# Altium project Soldeerbout.PrjPcb
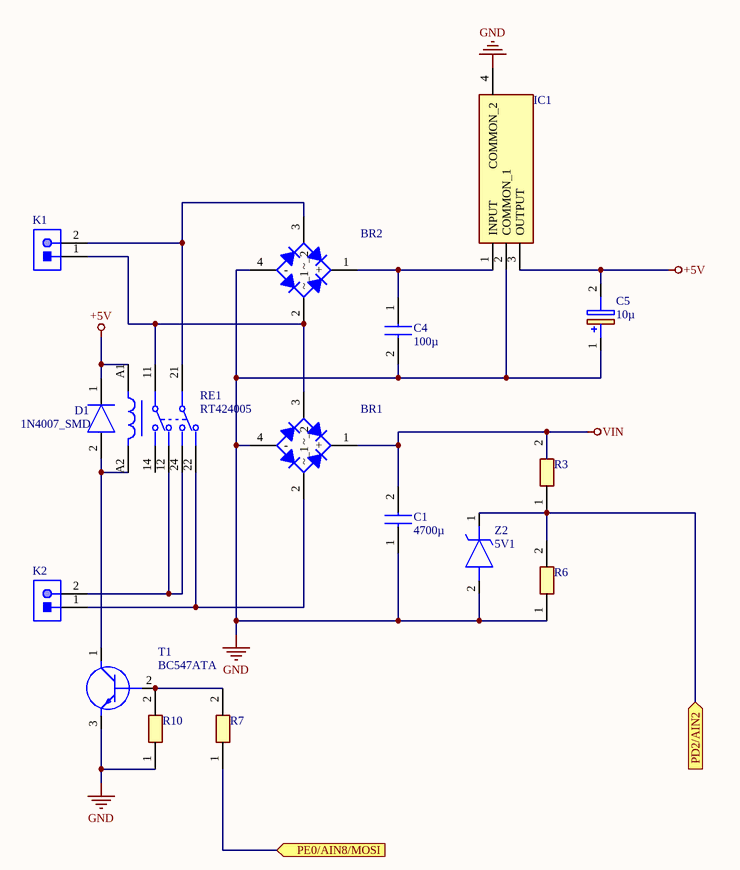
[diagram p0: Voeding.SchDoc]
4 sheets, 76 parts. Net scope: flat (ports and power ports of the same name join across sheets).
Board file: Soldeerstation.PcbDoc
Sheets:
  Voeding.SchDoc
  Atmega.SchDoc
  Boutconectie.SchDoc
  Display.SchDoc

## Sheet Voeding.SchDoc
size A4; SheetNumber: 1; SheetTotal: 4

### Parts
BR1  GBU6J-E3_45  [GBU6JE345]  (value not drawn)
BR2  GBU6J-E3_45  [GBU6JE345]  (value not drawn)
C1  4700µ  [CAPPRD1000W80D2200H4100]
C4  100µ  [CAPPRD350W52D800H1300]
C5  10µ  [CAPPRD200W52D500H1250]
D1  1N4007_SMD  [DIOM5027X262N]
IC1  TL780-05CKTTR  [TL78005CKTTR]  (value not drawn)
K1  620102131822  [620102131822]  (value not drawn)
K2  620102131822  [620102131822]  (value not drawn)
R3  (no value)  [RESC2012X90N]
R6  (no value)  [RESC2012X90N]
R7  (no value)  [RESC2012X90N]
R10  (no value)  [RESC2012X90N]
RE1  RT424005  [RT42]
T1  BC547ATA  [TO-92_(TO-226)]
Z2  5V1  [SODFL1608X65N]

### Ports
PD2/AIN2 (in), PE0/AIN8/MOSI (in)

### Nets
+5V: C5.2(-) D1.1(K) IC1.3(OUTPUT) RE1.A1
GND: BR1.4(-) BR2.4(-) C1.1(+) C4.2(-) C5.1(+) IC1.2(COMMON_1) IC1.4(COMMON_2) R6.1 R10.1 T1.3(E) Z2.2(A)
VIN: BR1.1(+) C1.2(-) R3.2
NetBR1_2: BR1.2(~_1) K2.1 RE1.22
NetBR1_3: BR1.3(~_2) BR2.2(~_1) K1.1 RE1.11
NetBR2_1: BR2.1(+) C4.1(+) IC1.1(INPUT)
NetBR2_3: BR2.3(~_2) K1.2 RE1.21
NetD1_2: D1.2(A) RE1.A2 T1.1(C)
NetK2_2: K2.2 RE1.12 RE1.24
NetR3_1: R3.1 R6.2 Z2.1(K) ; port PD2/AIN2
NetR7_1: R7.1 ; port PE0/AIN8/MOSI
NetR7_2: R7.2 R10.2 T1.2(B)

Not connected (* = marked no-connect by the designer): RE1 14

### Library data of the parts
BR1 BR2 = GBU6J-E3_45: Bridge Rectifier; Manufacturer_Name: Vishay; Manufacturer_Part_Number: GBU6J-E3/45; Datasheet Link: http://www.vishay.com/docs/88615/gbu6a.pdf; Height: 18.8mm
C1 = 860010683032: Capacitor; Manufacturer_Name: Wurth Elektronik; Datasheet Link: https://componentsearchengine.com/Datasheets/2/860010683032.pdf; Height: 41mm; Manufacturer_Part_Number: 860010683032; Mouser Part Number: 710-860010683032; Mouser Price/Stock: https://www.mouser.co.uk/ProductDetail/Wurth-Elektronik/860010683032?qs=0KOYDY2FL2%252Biyra9tgGF6Q%3D%3D
C4 = 860010674014: Capacitor; Manufacturer_Name: Wurth Elektronik; Datasheet Link: http://uk.rs-online.com/web/p/products/8397074; Height: 13mm; Manufacturer_Part_Number: 860010674014; Mouser Part Number: 710-860010674014; Mouser Price/Stock: https://www.mouser.co.uk/ProductDetail/Wurth-Elektronik/860010674014?qs=0KOYDY2FL2%2Fk%2F1RkUOIquw%3D%3D
C5 = 860010672009: Capacitor Polarised; Manufacturer_Name: Wurth Elektronik; Datasheet Link: https://componentsearchengine.com/Datasheets/2/860010672009.pdf; Height: 12.5mm; Manufacturer_Part_Number: 860010672009; Mouser Part Number: 710-860010672009; Mouser Price/Stock: https://www.mouser.com/Search/Refine.aspx?Keyword=710-860010672009
D1 = 1N4007_SMD: Diode; Manufacturer_Name: MULTICOMP; Manufacturer_Part_Number: 1N4007 SMD; Datasheet Link: https://componentsearchengine.com/Datasheets/2/1N4007 SMD.pdf; Height: 2.62mm
IC1 = TL780-05CKTTR: Integrated Circuit; Manufacturer_Name: Texas Instruments; Datasheet Link: http://www.ti.com/general/docs/suppproductinfo.tsp?distId=26&gotoUrl=http%3A%2F%2Fwww.ti.com%2Flit%2Fgpn%2Ftl780; Height: 5.08mm; Manufacturer_Part_Number: TL780-05CKTTR; Mouser Part Number: 595-TL780-05CKTTR; Mouser Price/Stock: https://www.mouser.co.uk/ProductDetail/Texas-Instruments/TL780-05CKTTR?qs=7kv20MEVUlhtPP21hgiOlA%3D%3D; Arrow Part Number: TL780-05CKTTR; Arrow Price/Stock: https://www.arrow.com/en/products/tl780-05ckttr/texas-instruments?region=nac
K1 K2 = CMP-1502-00669-1: Male Shrouded Header WR-WTB, SMT, Right Angled, pitch 2 mm, 1 x 2 position; Manufacturer: Wurth Elektronik; Position: 1x2; Working Voltage: 100VAC; Contact Resistance: 20mOhm; Pitch: 2mm; Packaging: TapeandReel; Part Number: 620102131822; Publisher: WurthElektronik; Mounting Technology: SMT; Manufacturer URL: http://www.we-online.de; Datasheet URL: https://katalog.we-online.de/em/datasheet/6201xx131822.pdf; Gender: Male; Operating Temperature: -25to85degC; Package Reference: 620102131822; Orientation: RightAngled
R3 R6 R7 R10 = CFN0805-JZ-R010ELF: Resistor; Manufacturer_Name: Bourns; Datasheet Link: https://www.bourns.com/docs/Product-Datasheets/CFN.pdf; Height: 0.9mm; Manufacturer_Part_Number: CFN0805-JZ-R010ELF
RE1 = RT424005: Relay or Contactor; Manufacturer_Name: TE Connectivity; Datasheet Link: https://www.te.com/commerce/DocumentDelivery/DDEController?Action=showdoc&DocId=Data+Sheet%7FRT2%7F1014%7Fpdf%7FEnglish%7FENG_DS_RT2_1014.pdf%7F5-1393243-9; Manufacturer_Part_Number: RT424005; Mouser Part Number: 655-RT424005; Mouser Price/Stock: https://www.mouser.co.uk/ProductDetail/TE-Connectivity-Schrack/RT424005?qs=KKrrU%252BaSadKRsQcVuAjnsQ%3D%3D; Arrow Part Number: RT424005; Arrow Price/Stock: https://www.arrow.com/en/products/rt424005/te-connectivity?region=nac
T1 = BC547ATA: Transistor BJT NPN; Manufacturer_Name: ON Semiconductor; Datasheet Link: https://www.onsemi.com/pub/Collateral/BC550-D.pdf; Manufacturer_Part_Number: BC547ATA; Mouser Part Number: 512-BC547ATA; Mouser Price/Stock: https://www.mouser.co.uk/ProductDetail/ON-Semiconductor-Fairchild/BC547ATA?qs=ljbEvF4DwOMRdLfuzO8N4w%3D%3D; Arrow Part Number: BC547ATA; Arrow Price/Stock: https://www.arrow.com/en/products/bc547ata/on-semiconductor?region=europe
Z2 = BZT52C12TQ-7-F: Zener Diode; Manufacturer_Name: Diodes Inc.; Datasheet Link: https://www.diodes.com/assets/Datasheets/ds30502.pdf; Height: 0.65mm; Manufacturer_Part_Number: BZT52C12TQ-7-F; Mouser Part Number: 621-BZT52C12TQ-7-F; Mouser Price/Stock: https://www.mouser.co.uk/ProductDetail/Diodes-Incorporated/BZT52C12TQ-7-F?qs=W0yvOO0ixfHNmW9JdWu87w%3D%3D; Arrow Part Number: BZT52C12TQ-7-F; Arrow Price/Stock: https://www.arrow.com/en/products/bzt52c12tq-7-f/diodes-incorporated?region=nac

## Sheet Atmega.SchDoc
size A4; SheetNumber: 2; SheetTotal: 4
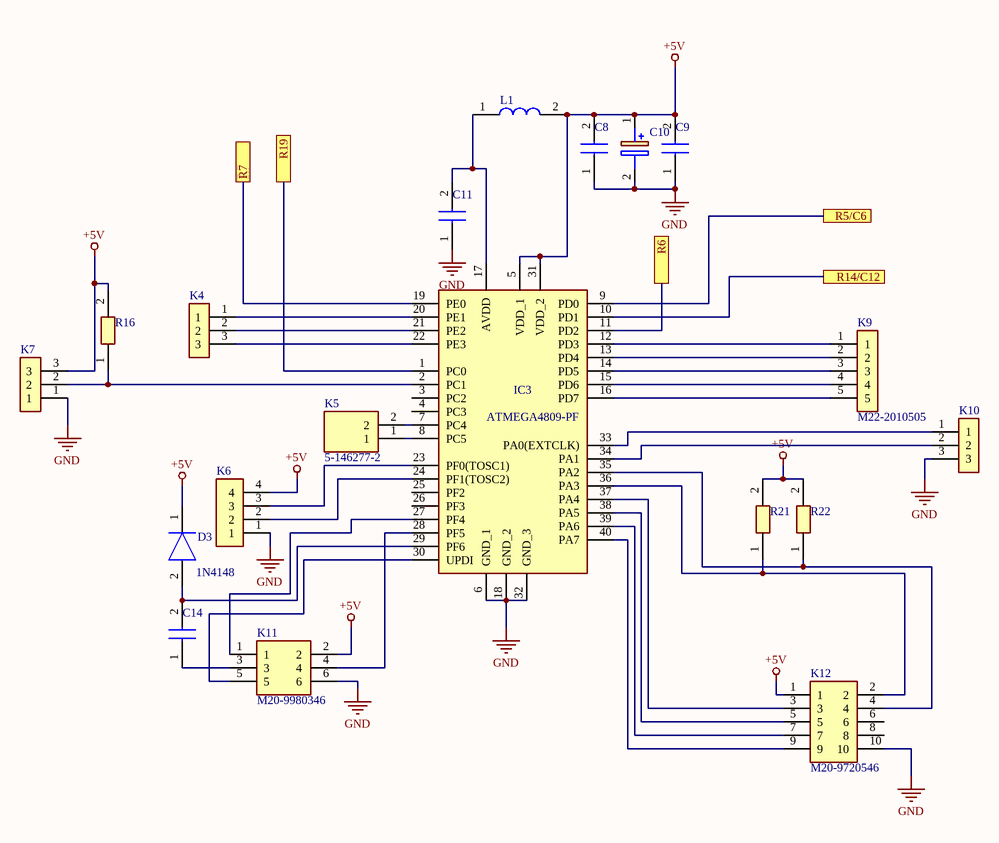
[diagram p1: Atmega.SchDoc]

### Parts
C8  (no value)  [CAPC2012X95N]
C9  (no value)  [CAPC2012X95N]
C10  10µ  [CAPPRD200W52D500H1250]  (value not drawn)
C11  (no value)  [CAPC2012X95N]
C14  (no value)  [CAPC2012X95N]
D3  1N4148  [1N4148WRHG]
IC3  ATMEGA4809-PF  [DIP1543W58P254L5175H635Q40N]
K4  09-65-2038  [SHDR3W160P0X396_1X3_1112X1062X1425P]  (value not drawn)
K5  5-146277-2  [HDRV2W67P0X254_1X2_467X234X823P]
K6  (no value)  [HDRV4W64P0X254_1X4_1016X254X864P]
K7  (no value)  [HDRV3W60P0X200_1X3_600X200X525P]
K9  M22-2010505  [HDRV5W50P0X200_1X5_1000X200X530P]
K10  (no value)  [HDRV3W60P0X200_1X3_600X200X525P]
K11  M20-9980346  [HDRV6W64P254_2X3_762X508X868P]
K12  M20-9720546  [HDRV10W64P254_2X5_1270X508X954P]
L1  FDSD0518-H-100M=P3  [FDSD0518H100MP3]  (value not drawn)
R16  (no value)  [RESC2012X90N]
R21  (no value)  [RESC2012X90N]
R22  (no value)  [RESC2012X90N]

### Ports
R5/C6, R6, R7, R14/C12, R19

### Nets
+5V: C8.2 C9.2 C10.1(+) D3.1(K) IC3.5(VDD_1) IC3.31(VDD_2) K6.4 K7.3 K11.2 K12.1 L1.2 R16.2 R21.2 R22.2
GND: C8.1 C9.1 C10.2(-) C11.1 IC3.6(GND_1) IC3.18(GND_2) IC3.32(GND_3) K6.1 K7.1 K10.3 K11.6 K12.10
NetC11_2: C11.2 IC3.17(AVDD) L1.1
NetC14_1: C14.1 K11.3
NetC14_2: C14.2 D3.2(A) IC3.29(PF6)
NetIC3_1: IC3.1(PC0) ; port R19
NetIC3_2: IC3.2(PC1) K7.2 R16.1
NetIC3_7: IC3.7(PC4) K5.2
NetIC3_8: IC3.8(PC5) K5.1
NetIC3_9: IC3.9(PD0) ; port R5/C6
NetIC3_10: IC3.10(PD1) ; port R14/C12
NetIC3_11: IC3.11(PD2) ; port R6
NetIC3_12: IC3.12(PD3) K9.1
NetIC3_13: IC3.13(PD4) K9.2
NetIC3_14: IC3.14(PD5) K9.3
NetIC3_15: IC3.15(PD6) K9.4
NetIC3_16: IC3.16(PD7) K9.5
NetIC3_19: IC3.19(PE0) ; port R7
NetIC3_20: IC3.20(PE1) K4.1
NetIC3_21: IC3.21(PE2) K4.2
NetIC3_22: IC3.22(PE3) K4.3
NetIC3_23: IC3.23(PF0(TOSC1)) K6.3
NetIC3_24: IC3.24(PF1(TOSC2)) K6.2
NetIC3_27: IC3.27(PF4) K11.1
NetIC3_28: IC3.28(PF5) K11.4
NetIC3_30: IC3.30(UPDI) K11.5
NetIC3_33: IC3.33(PA0(EXTCLK)) K10.1
NetIC3_34: IC3.34(PA1) K10.2
NetIC3_35: IC3.35(PA2) K12.4 R22.1
NetIC3_36: IC3.36(PA3) K12.2 R21.1
NetIC3_37: IC3.37(PA4) K12.3
NetIC3_38: IC3.38(PA5) K12.5
NetIC3_39: IC3.39(PA6) K12.7
NetIC3_40: IC3.40(PA7) K12.9

Not connected (* = marked no-connect by the designer): IC3 3(PC2) 4(PC3) 25(PF2) 26(PF3); K12 6 8

### Library data of the parts
C8 C9 C11 C14 = CC0805KPX7R9BB104: Capacitor; Manufacturer_Name: KEMET; Datasheet Link: https://www.yageo.com/upload/media/product/productsearch/datasheet/mlcc/UPY-GPHC_X7R_6.3V-to-50V_20.pdf; Height: 0.95mm; Manufacturer_Part_Number: CC0805KPX7R9BB104
C10 = 860010672009: as C5 on sheet Voeding; Datasheet Link: https://componentsearchengine.com/Datasheets/2/860010672009.pdf; Height: 12.5mm; Manufacturer_Part_Number: 860010672009; Mouser Part Number: 710-860010672009; Mouser Price/Stock: https://www.mouser.com/Search/Refine.aspx?Keyword=710-860010672009
D3 = 1N4148W_RHG: Diode; Manufacturer_Name: Taiwan Semiconductor; Manufacturer_Part_Number: 1N4148W RHG; Datasheet Link: https://mouser.componentsearchengine.com/Datasheets/1/1N4148W RHG.pdf; Height: 1.15mm; Mouser Part Number: 821-1N4148WRHG; Mouser Price/Stock: https://www.mouser.co.uk/ProductDetail/Taiwan-Semiconductor/1N4148W-RHG?qs=KwaGCOX4wIag2YPLXylAvA%3D%3D; Arrow Part Number: 1N4148W RHG; Arrow Price/Stock: https://www.arrow.com/en/products/1n4148wrhg/taiwan-semiconductor?region=nac
IC3 = ATMEGA4809-PF: Integrated Circuit; Manufacturer_Name: Microchip; Datasheet Link: http://ww1.microchip.com/downloads/en/DeviceDoc/40-pin-Data-Sheet-megaAVR-0-series-DS40002104A.pdf; Height: 6.35mm; Manufacturer_Part_Number: ATMEGA4809-PF; Mouser Part Number: 556-ATMEGA4809-PF; Mouser Price/Stock: https://www.mouser.co.uk/ProductDetail/Microchip-Technology-Atmel/ATMEGA4809-PF?qs=T3oQrply3y9UlpZbCygk%252BQ%3D%3D
K4 = 09-65-2038: Connector; Manufacturer_Name: Molex; Datasheet Link: https://www.molex.com/pdm_docs/sd/009652038_sd.pdf; Height: 14.25mm; Manufacturer_Part_Number: 09-65-2038; Mouser Part Number: 538-09-65-2038; Mouser Price/Stock: https://www.mouser.co.uk/ProductDetail/Molex/09-65-2038?qs=A%252B%2FNCR0PvNU%2FSwDn3lpSlg%3D%3D
K5 = 5-146277-2: Connector; Manufacturer_Name: TE Connectivity; Datasheet Link: https://componentsearchengine.com//5-146277-2.pdf; Height: 8.23mm; Mouser2 Part Number: 571-5-146277-2; Mouser2 Price/Stock: https://www.mouser.com/Search/Refine.aspx?Keyword=571-5-146277-2; Manufacturer_Part_Number: 5-146277-2
K6 = M20-9990445: Connector; Manufacturer_Name: Harwin; Datasheet Link: https://cdn.harwin.com/pdfs/M20-999.pdf; Height: 8.64mm; Manufacturer_Part_Number: M20-9990445
K7 K10 = M22-2010305: Connector; Manufacturer_Name: Harwin; Datasheet Link: https://componentsearchengine.com//M22-2010305.pdf; Height: 5.25mm; Mouser2 Part Number: 855-M22-2010305; Mouser2 Price/Stock: https://www.mouser.com/Search/Refine.aspx?Keyword=855-M22-2010305; Manufacturer_Part_Number: M22-2010305
K9 = M22-2010505: Connector; Manufacturer_Name: Harwin; Datasheet Link: https://datasheet.datasheetarchive.com/originals/distributors/Datasheets-20/DSA-391131.pdf; Height: 5.3mm; Manufacturer_Part_Number: M22-2010505
K11 = M20-9980346: Connector; Manufacturer_Name: Harwin; Datasheet Link: https://componentsearchengine.com//M20-9980346.pdf; Height: 8.68mm; Mouser2 Part Number: 855-M20-9980346; Mouser2 Price/Stock: https://www.mouser.com/Search/Refine.aspx?Keyword=855-M20-9980346; Manufacturer_Part_Number: M20-9980346
K12 = M20-9720546: Connector; Manufacturer_Name: Harwin; Datasheet Link: https://cdn.harwin.com/pdfs/M20-972.pdf; Height: 9.54mm; Manufacturer_Part_Number: M20-9720546
L1 = FDSD0518-H-100M=P3: Inductor; Manufacturer_Name: Murata Electronics; Datasheet Link: https://psearch.en.murata.com/inductor/product/FDSD0518-H-100M%23.html; Height: 1.8mm; Manufacturer_Part_Number: FDSD0518-H-100M=P3
R16 R21 R22 = CFN0805-JZ-R010ELF: Resistor; Manufacturer_Name: Bourns; Datasheet Link: https://www.bourns.com/docs/Product-Datasheets/CFN.pdf; Height: 0.9mm; Manufacturer_Part_Number: CFN0805-JZ-R010ELF

## Sheet Boutconectie.SchDoc
size A4; SheetNumber: 3; SheetTotal: 4
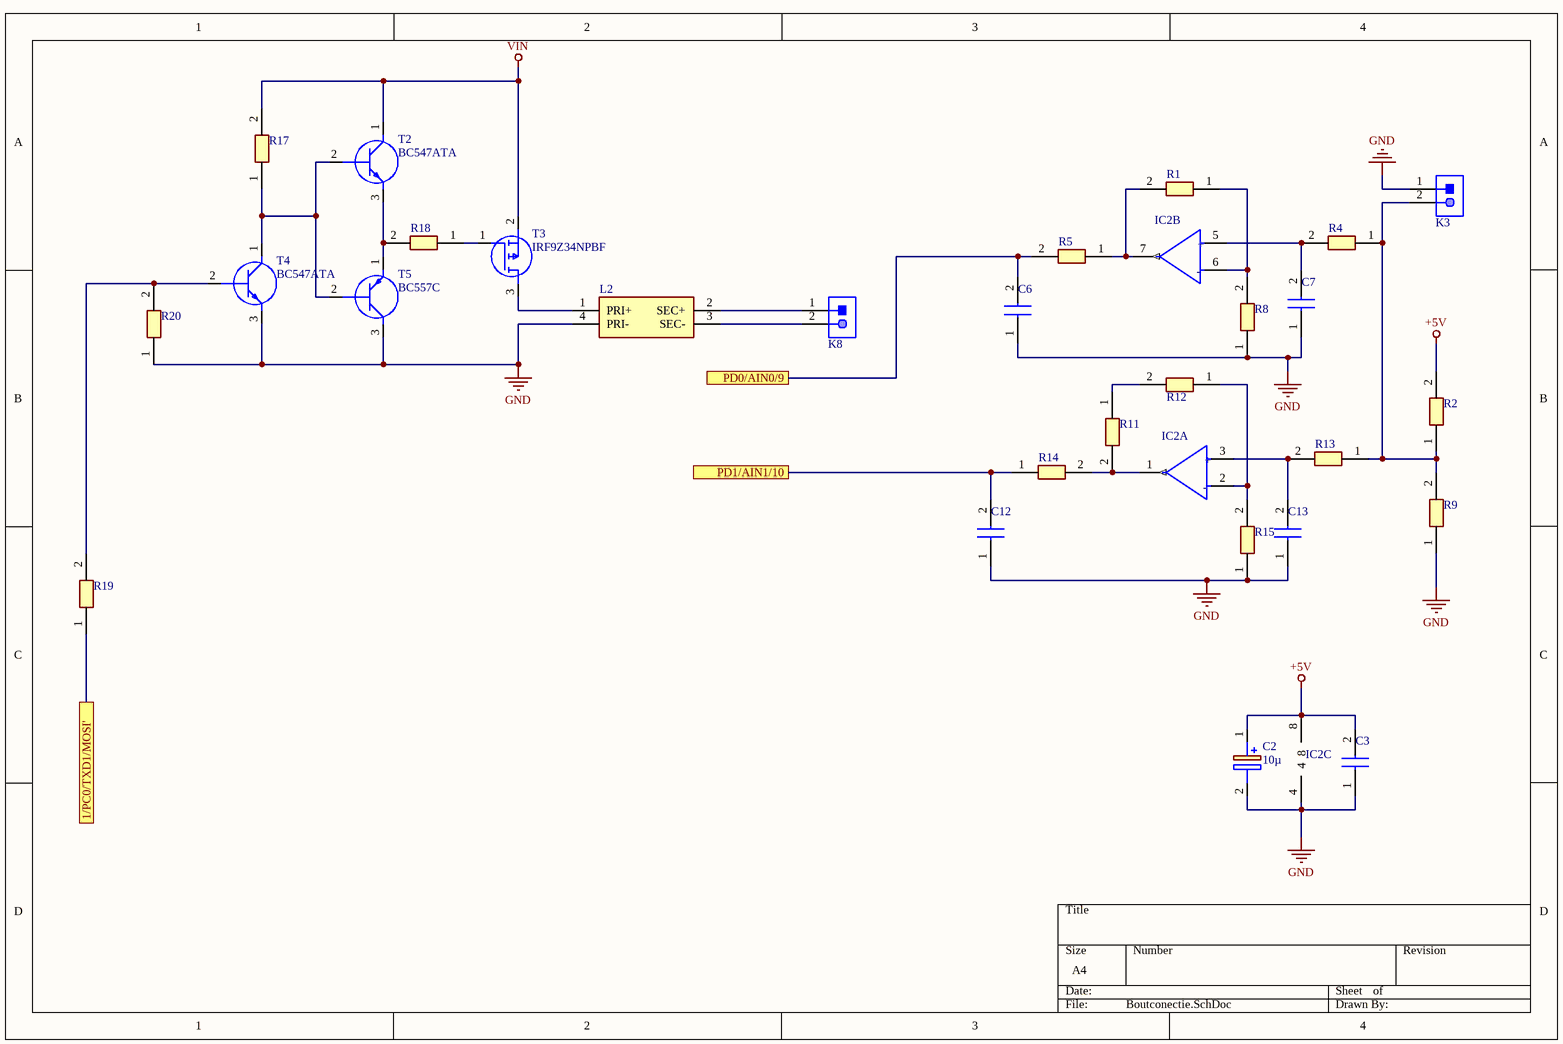
[diagram p2: Boutconectie.SchDoc]

### Parts
C2  10µ  [CAPPRD200W52D500H1250]
C3  (no value)  [CAPC2012X95N]
C6  (no value)  [CAPC2012X95N]
C7  (no value)  [CAPC2012X95N]
C12  (no value)  [CAPC2012X95N]
C13  (no value)  [CAPC2012X95N]
IC2  MCP6002-E_P  [DIP781W56P254L950H533Q8N]  (value not drawn)  (parts A,B,C of 3)
K3  620102131822  [620102131822]  (value not drawn)
K8  620102131822  [620102131822]  (value not drawn)
L2  CM2545X171B-10  [CM2545X171B10]  (value not drawn)
R1  (no value)  [RESC2012X90N]
R2  (no value)  [RESC2012X90N]
R4  (no value)  [RESC2012X90N]
R5  (no value)  [RESC2012X90N]
R8  (no value)  [RESC2012X90N]
R9  (no value)  [RESC2012X90N]
R11  (no value)  [RESC2012X90N]
R12  (no value)  [RESC2012X90N]
R13  (no value)  [RESC2012X90N]
R14  (no value)  [RESC2012X90N]
R15  (no value)  [RESC2012X90N]
R17  (no value)  [RESC2012X90N]
R18  (no value)  [RESC2012X90N]
R19  (no value)  [RESC2012X90N]
R20  (no value)  [RESC2012X90N]
T2  BC547ATA  [TO-92_(TO-226)]
T3  IRF9Z34NPBF  [TO254P469X1042X1967-3P]
T4  BC547ATA  [TO-92_(TO-226)]
T5  BC557C  [BC557C]

### Ports
1/PC0/TXD1/MOSI', PD0/AIN0/9, PD1/AIN1/10

### Nets
+5V: C2.1(+) C3.2 IC2.8 R2.2
GND: C2.2(-) C3.1 C6.1 C7.1 C12.1 C13.1 IC2.4 K3.1 L2.4(PRI-) R8.1 R9.1 R15.1 R20.1 T4.3(E) T5.3(C)
VIN: R17.2 T2.1(C) T3.2(S)
NetC6_2: C6.2 R5.2 ; port PD0/AIN0/9
NetC7_2: C7.2 IC2.5(2IN+) R4.2
NetC12_2: C12.2 R14.1 ; port PD1/AIN1/10
NetC13_2: C13.2 IC2.3(2IN+) R13.2
NetIC2_1: IC2.1(2OUT) R11.2 R14.2
NetIC2_2: IC2.2(2IN-) R12.1 R15.2
NetIC2_6: IC2.6(2IN-) R1.1 R8.2
NetIC2_7: IC2.7(2OUT) R1.2 R5.1
NetK3_2: K3.2 R2.1 R4.1 R9.2 R13.1
NetK8_1: K8.1 L2.2(SEC+)
NetK8_2: K8.2 L2.3(SEC-)
NetL2_1: L2.1(PRI+) T3.3(D)
NetR11_1: R11.1 R12.2
NetR17_1: R17.1 T2.2(B) T4.1(C) T5.2(B)
NetR18_1: R18.1 T3.1(G)
NetR18_2: R18.2 T2.3(E) T5.1(E)
NetR19_1: R19.1 ; port 1/PC0/TXD1/MOSI'
NetR19_2: R19.2 R20.2 T4.2(B)

### Notes on the sheet
- (in symbol MCP6002-E_P, part A) +; -
- (in symbol MCP6002-E_P, part B) +; -

### Library data of the parts
C2 = 860010672009: as C5 on sheet Voeding; Datasheet Link: https://componentsearchengine.com/Datasheets/2/860010672009.pdf; Height: 12.5mm; Manufacturer_Part_Number: 860010672009; Mouser Part Number: 710-860010672009; Mouser Price/Stock: https://www.mouser.com/Search/Refine.aspx?Keyword=710-860010672009
C3 C6 C7 C12 C13 = CC0805KPX7R9BB104: Capacitor; Manufacturer_Name: KEMET; Datasheet Link: https://www.yageo.com/upload/media/product/productsearch/datasheet/mlcc/UPY-GPHC_X7R_6.3V-to-50V_20.pdf; Height: 0.95mm; Manufacturer_Part_Number: CC0805KPX7R9BB104
IC2 = MCP6002-E_P: Integrated Circuit; Manufacturer_Name: Microchip; Manufacturer_Part_Number: MCP6002-E/P; Datasheet Link: http://componentsearchengine.com/Datasheets/3/MCP6002-E_P.pdf; Height: 5.334mm; Mouser Part Number: 579-MCP6002-E/P; Mouser Price/Stock: https://www.mouser.co.uk/ProductDetail/Microchip-Technology/MCP6002-E-P?qs=hul3WK2zl4pqRWzdnAsu%2FQ%3D%3D; Arrow Part Number: MCP6002-E/P; Arrow Price/Stock: https://www.arrow.com/en/products/mcp6002-ep/microchip-technology?region=nac
K3 K8 = CMP-1502-00669-1: as K1 on sheet Voeding; Packaging: TapeandReel; Part Number: 620102131822; Publisher: WurthElektronik; Mounting Technology: SMT; Manufacturer URL: http://www.we-online.de; Datasheet URL: https://katalog.we-online.de/em/datasheet/6201xx131822.pdf; Gender: Male; Operating Temperature: -25to85degC; Package Reference: 620102131822; Orientation: RightAngled
L2 = CM2545X171B-10: Transformer; Manufacturer_Name: Laird Technologies; Datasheet Link: https://datasheet.datasheetarchive.com/originals/dk/DKDS-7/122753.pdf; Height: 9.5mm; Manufacturer_Part_Number: CM2545X171B-10; Mouser Part Number: N/A; Mouser Price/Stock: https://www.mouser.co.uk/ProductDetail/Laird/CM2545X171B-10?qs=PzGy0jfpSMtNfkEypgU65A%3D%3D; Arrow Part Number: CM2545X171B-10; Arrow Price/Stock: https://www.arrow.com/en/products/cm2545x171b-10/laird-technologies
R1 R2 R4 R5 R8 R9 R11-R15 R17-R20 = CFN0805-JZ-R010ELF: Resistor; Manufacturer_Name: Bourns; Datasheet Link: https://www.bourns.com/docs/Product-Datasheets/CFN.pdf; Height: 0.9mm; Manufacturer_Part_Number: CFN0805-JZ-R010ELF
T2 T4 = BC547ATA: as T1 on sheet Voeding; Datasheet Link: https://www.onsemi.com/pub/Collateral/BC550-D.pdf; Manufacturer_Part_Number: BC547ATA; Mouser Part Number: 512-BC547ATA; Mouser Price/Stock: https://www.mouser.co.uk/ProductDetail/ON-Semiconductor-Fairchild/BC547ATA?qs=ljbEvF4DwOMRdLfuzO8N4w%3D%3D; Arrow Part Number: BC547ATA; Arrow Price/Stock: https://www.arrow.com/en/products/bc547ata/on-semiconductor?region=europe
T3 = IRF9Z34NPBF: MOSFET (P-Channel); Manufacturer_Name: Infineon; Datasheet Link: https://www.infineon.com/dgdl/irf9z34npbf.pdf?fileId=5546d462533600a40153561220af1ddd; Height: 4.69mm; Manufacturer_Part_Number: IRF9Z34NPBF; Mouser Part Number: 942-IRF9Z34NPBF; Mouser Price/Stock: https://www.mouser.co.uk/ProductDetail/Infineon-IR/IRF9Z34NPBF?qs=9%252BKlkBgLFf16a%2FvlD%252BMCtQ%3D%3D; Arrow Part Number: IRF9Z34NPBF; Arrow Price/Stock: https://www.arrow.com/en/products/irf9z34npbf/infineon-technologies-ag?region=nac
T5 = BC557C: Transistor BJT PNP; Manufacturer_Name: NXP; Datasheet Link: http://uk.rs-online.com/web/p/products/1124775; Height: 5.2mm; Manufacturer_Part_Number: BC557C; Mouser Part Number: 771-BC557C; Mouser Price/Stock: https://www.mouser.co.uk/ProductDetail/NXP-Semiconductors/BC557C?qs=84A%2FDAdkstLO1yR4NjQrgg%3D%3D

## Sheet Display.SchDoc
size A4; SheetNumber: 4; SheetTotal: 4
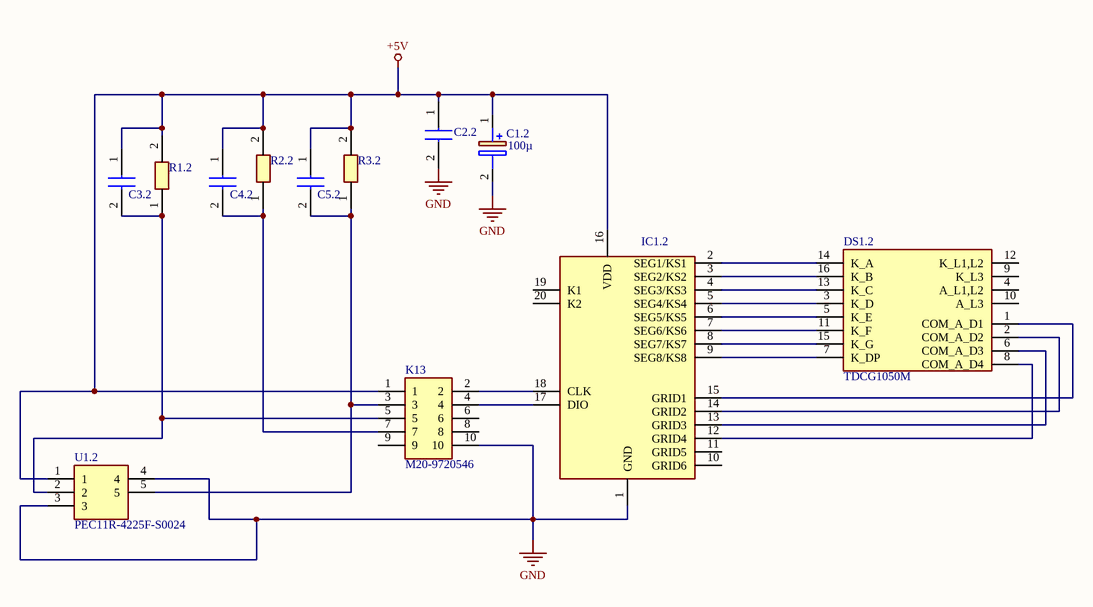
[diagram p3: Display.SchDoc]

### Parts
C1.2  100µ  [CAPPRD200W52D500H1250]
C2.2  860010674014  [CAPPRD350W52D800H1300]  (value not drawn)
C3.2  860010674014  [CAPPRD350W52D800H1300]  (value not drawn)
C4.2  860010674014  [CAPPRD350W52D800H1300]  (value not drawn)
C5.2  860010674014  [CAPPRD350W52D800H1300]  (value not drawn)
DS1.2  TDCG1050M  [DIPS1016W75P254L4020H725Q16N]
IC1.2  TM1637__SOP_  [SOIC127P1045X280-20N]  (value not drawn)
K13  M20-9720546  [HDRV10W64P254_2X5_1270X508X954P]
R1.2  (no value)  [RESC2012X90N]
R2.2  (no value)  [RESC2012X90N]
R3.2  (no value)  [RESC2012X90N]
U1.2  PEC11R-4225F-S0024  [PEC12R-4XXXF-SXXXX_1]

### Nets
+5V: C1.2.1(+) C2.2.1(+) C3.2.1(+) C4.2.1(+) C5.2.1(+) IC1.2.16(VDD) K13.1 R1.2.2 R2.2.2 R3.2.2 U1.2.1
GND: C1.2.2(-) C2.2.2(-) IC1.2.1(GND) K13.10 U1.2.3 U1.2.4
NetC3.2_2: C3.2.2(-) K13.5 R1.2.1 U1.2.2
NetC4.2_2: C4.2.2(-) K13.7 R2.2.1
NetC5.2_2: C5.2.2(-) K13.3 R3.2.1 U1.2.5
NetDS1.2_1: DS1.2.1(COM_A_D1) IC1.2.15(GRID1)
NetDS1.2_2: DS1.2.2(COM_A_D2) IC1.2.14(GRID2)
NetDS1.2_3: DS1.2.3(K_D) IC1.2.5(SEG4/KS4)
NetDS1.2_5: DS1.2.5(K_E) IC1.2.6(SEG5/KS5)
NetDS1.2_6: DS1.2.6(COM_A_D3) IC1.2.13(GRID3)
NetDS1.2_7: DS1.2.7(K_DP) IC1.2.9(SEG8/KS8)
NetDS1.2_8: DS1.2.8(COM_A_D4) IC1.2.12(GRID4)
NetDS1.2_11: DS1.2.11(K_F) IC1.2.7(SEG6/KS6)
NetDS1.2_13: DS1.2.13(K_C) IC1.2.4(SEG3/KS3)
NetDS1.2_14: DS1.2.14(K_A) IC1.2.2(SEG1/KS1)
NetDS1.2_15: DS1.2.15(K_G) IC1.2.8(SEG7/KS7)
NetDS1.2_16: DS1.2.16(K_B) IC1.2.3(SEG2/KS2)
NetIC1.2_17: IC1.2.17(DIO) K13.4
NetIC1.2_18: IC1.2.18(CLK) K13.2

Not connected (* = marked no-connect by the designer): DS1.2 4(A_L1,L2) 9(K_L3) 10(A_L3) 12(K_L1,L2); IC1.2 10(GRID6) 11(GRID5) 19(K1) 20(K2); K13 6 8 9

### Library data of the parts
C1.2 = 860010672009: as C5 on sheet Voeding; Datasheet Link: https://componentsearchengine.com/Datasheets/2/860010672009.pdf; Height: 12.5mm; Manufacturer_Part_Number: 860010672009; Mouser Part Number: 710-860010672009; Mouser Price/Stock: https://www.mouser.com/Search/Refine.aspx?Keyword=710-860010672009
C2.2 C3.2 C4.2 C5.2 = 860010674014: as C4 on sheet Voeding; Datasheet Link: http://uk.rs-online.com/web/p/products/8397074; Height: 13mm; Manufacturer_Part_Number: 860010674014; Mouser Part Number: 710-860010674014; Mouser Price/Stock: https://www.mouser.co.uk/ProductDetail/Wurth-Elektronik/860010674014?qs=0KOYDY2FL2%2Fk%2F1RkUOIquw%3D%3D
DS1.2 = TDCG1050M: Display; Manufacturer_Name: Vishay; Datasheet Link: https://www.vishay.com/docs/83180/tdcx10x0m.pdf; Height: 7.25mm; Manufacturer_Part_Number: TDCG1050M; Mouser Part Number: 78-TDCG1050; Mouser Price/Stock: https://www.mouser.co.uk/ProductDetail/Vishay-Semiconductors/TDCG1050M?qs=RzxYCzJDjPUa0IQ9xsk9iw%3D%3D; Arrow Part Number: TDCG1050M; Arrow Price/Stock: https://www.arrow.com/en/products/tdcg1050m/vishay?region=nac
IC1.2 = TM1637__SOP_: Integrated Circuit; Manufacturer_Name: TITAN MICRO ELECTRONICS; Manufacturer_Part_Number: TM1637 (SOP); Datasheet Link: https://www.mcielectronics.cl/website_MCI/static/documents/Datasheet_TM1637.pdf; Height: 2.8mm
K13 = M20-9720546: Connector; Manufacturer_Name: Harwin; Datasheet Link: https://cdn.harwin.com/pdfs/M20-972.pdf; Height: 9.54mm; Manufacturer_Part_Number: M20-9720546
R1.2 R2.2 R3.2 = CFN0805-JZ-R010ELF: Resistor; Manufacturer_Name: Bourns; Datasheet Link: https://www.bourns.com/docs/Product-Datasheets/CFN.pdf; Height: 0.9mm; Manufacturer_Part_Number: CFN0805-JZ-R010ELF
U1.2 = PEC11R-4225F-S0024: Undefined or Miscellaneous; Manufacturer_Name: Bourns; Datasheet Link: https://componentsearchengine.com/Datasheets/1/PEC11R-4225F-S0024.pdf; Manufacturer_Part_Number: PEC11R-4225F-S0024; Mouser Part Number: 652-PEC11R-4225F-S24; Mouser Price/Stock: https://www.mouser.co.uk/ProductDetail/Bourns/PEC11R-4225F-S0024?qs=Zq5ylnUbLm4N6UNkPX3pkQ%3D%3D; Arrow Part Number: PEC11R-4225F-S0024; Arrow Price/Stock: https://www.arrow.com/en/products/pec11r-4225f-s0024/bourns?region=nac

## Nets that join several sheets
+5V: Voeding (C5.2 D1.1 IC1.3 RE1.A1), Atmega (14 pins), Boutconectie (C2.1 C3.2 IC2.8 R2.2), Display (11 pins)
GND: Voeding (11 pins), Atmega (12 pins), Boutconectie (15 pins), Display (6 pins)
VIN: Voeding (BR1.1 C1.2 R3.2), Boutconectie (R17.2 T2.1 T3.2)